# EAGLE design Xenium2019 (EAGLE 9.5.1)
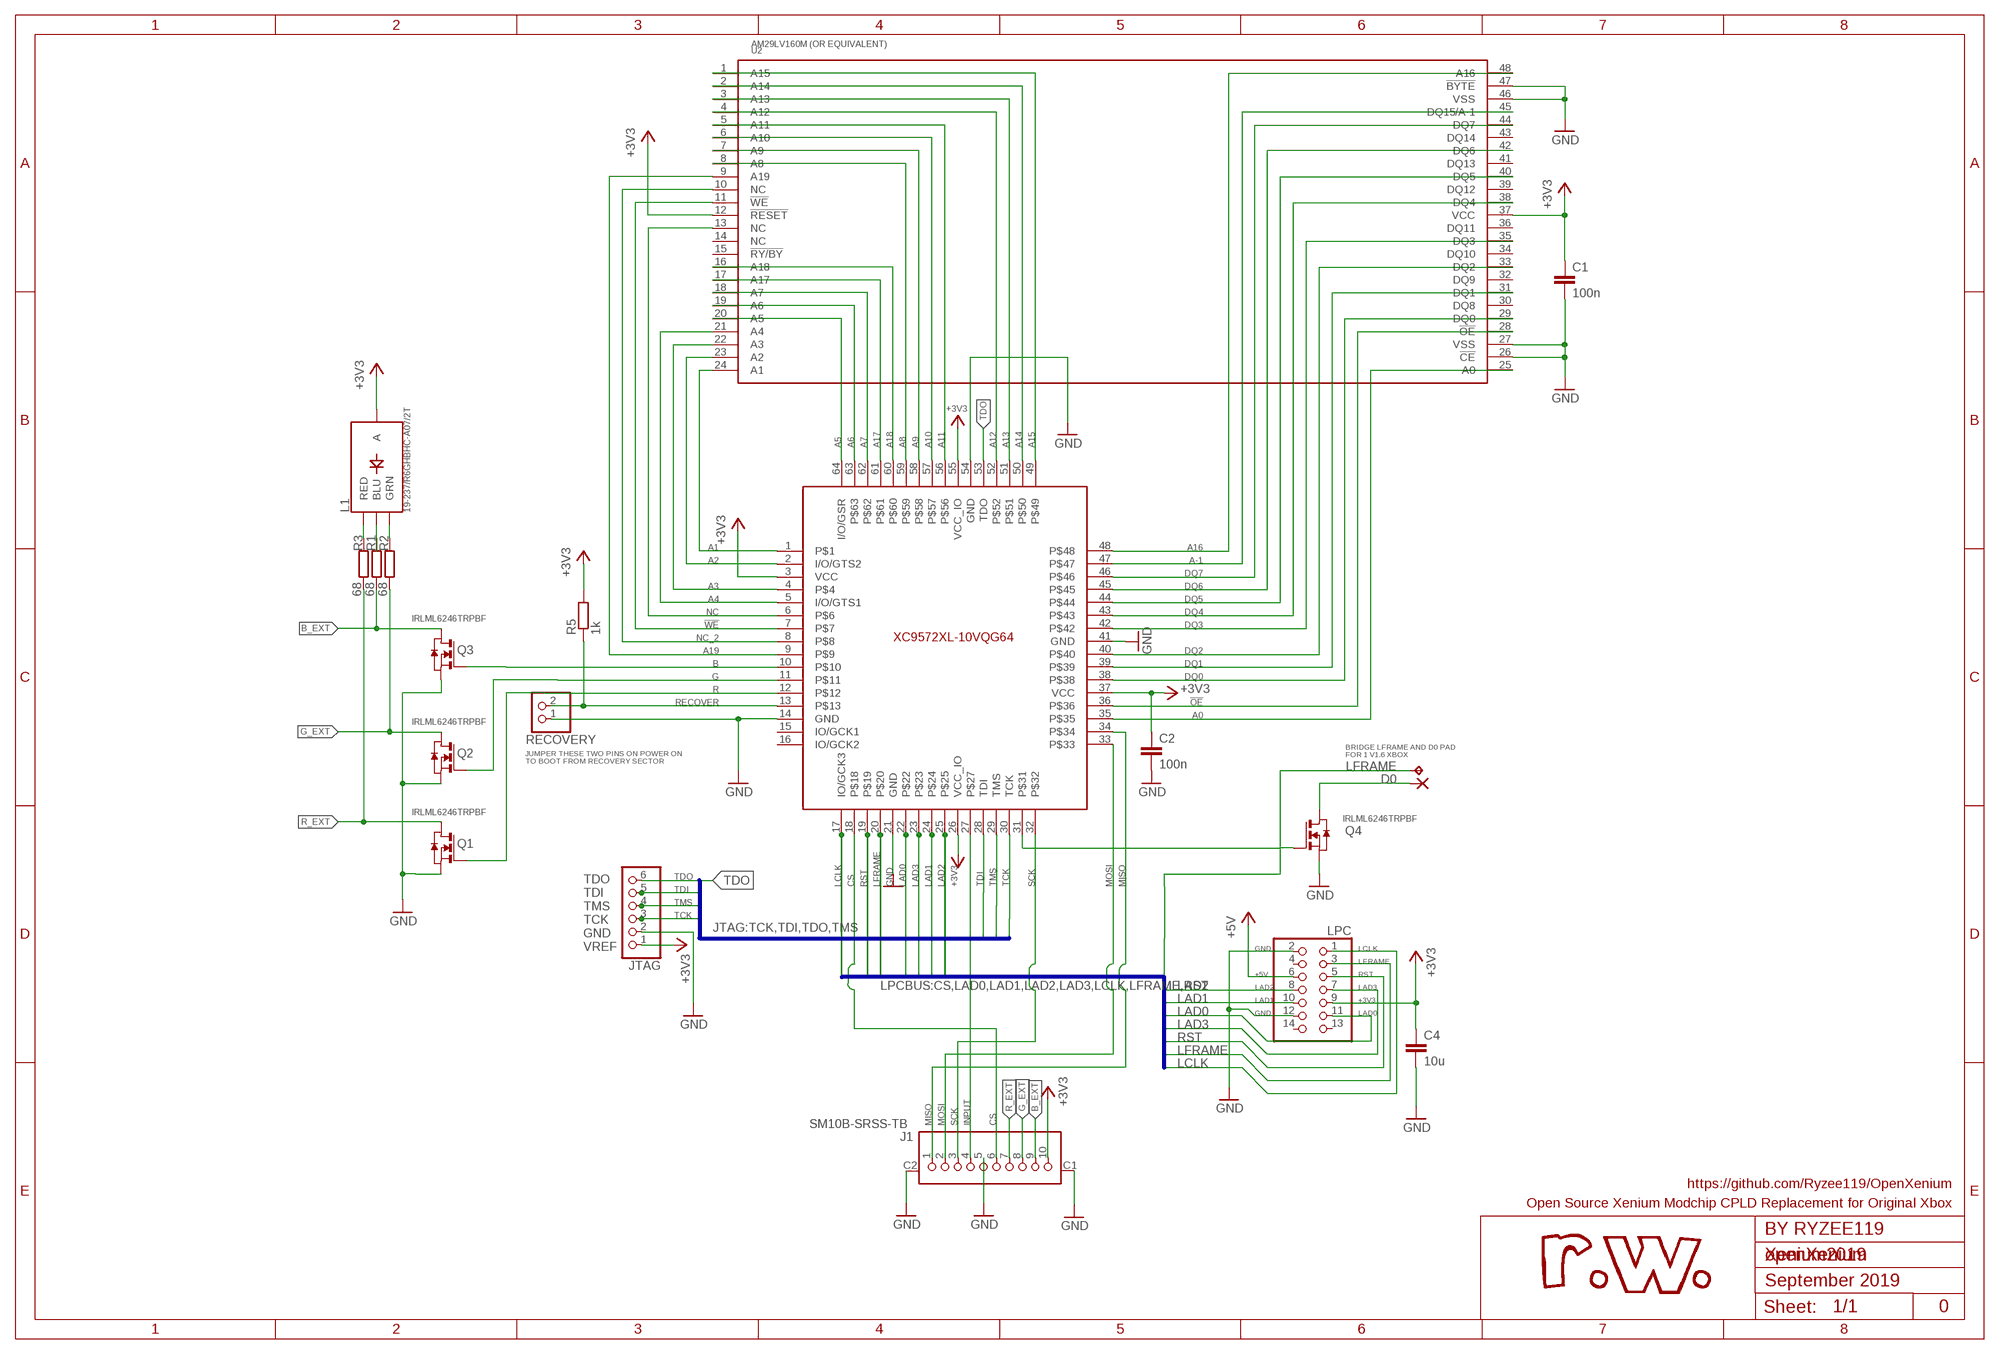
[diagram p0: schematic, sheet 1]

## Parts
C1  100n  C-EUC0603  [C0603]
C2  100n  C-EUC0603  [C0603]
C4  10u  C-EUC0603  [C0603]
D0  SMD2  [SMD1,27-2,54]
J1  SM10B-SRSS-TB  [SM10B-SRSS-TB]
JTAG  PINHD-1X6  [1X06]
L1  19-237/R6GHBHC-A07/2T  [4-SMD-R6GHBHC]
LPC  PINHD-2X7  [2X07]
Q1  310mA/60V/1.6Ω  NMOSSOT23  [SOT-23]
Q2  310mA/60V/1.6Ω  NMOSSOT23  [SOT-23]
Q3  310mA/60V/1.6Ω  NMOSSOT23  [SOT-23]
Q4  310mA/60V/1.6Ω  NMOSSOT23  [SOT-23]
R1  68  R-EU_R0603  [R0603]
R2  68  R-EU_R0603  [R0603]
R3  68  R-EU_R0603  [R0603]
R5  1k  R-EU_R0603  [R0603]
RECOVERY  PINHD-1X2  [1X02]
TP1  TPTP13SQ  [TP13SQ]
U1  XC9572XL-10VQG64  [LQFP64]
U2  AM29LV160M  [TSOP48]

## Nets
!OE: U1.36 U2.28(!OE)
!WE: U1.7 U2.11(!WE)
+3V3: C1.1 C2.1 C4.1 J1.10 JTAG.1 L1.P$2(A) LPC.9 R5.2 U1.3(VCC) U1.26(VCC_IO) U1.37(VCC) U1.55(VCC_IO) U2.12(!RESET) U2.37(VCC)
+5V: LPC.6
A0: U1.35 U2.25(A0)
A1: U1.1 U2.24(A1)
A2: U1.2(I/O/GTS2) U2.23(A2)
A3: U1.4 U2.22(A3)
A4: U1.5(I/O/GTS1) U2.21(A4)
A5: U1.64(I/O/GSR) U2.20(A5)
A6: U1.63 U2.19(A6)
A7: U1.62 U2.18(A7)
A8: U1.59 U2.8(A8)
A9: U1.58 U2.7(A9)
A10: U1.57 U2.6(A10)
A11: U1.56 U2.5(A11)
A12: U1.52 U2.4(A12)
A13: U1.51 U2.3(A13)
A14: U1.50 U2.2(A14)
A15: U1.49 U2.1(A15)
A16: U1.48 U2.48(A16)
A17: U1.61 U2.17(A17)
A18: U1.60 U2.16(A18)
A19: U1.9 U2.9(A19)
A-1: U1.47 U2.45(DQ15/A-1)
B: Q3.3(G) U1.10
B_EXT: J1.9 Q3.1(D) R1.2
BLUE: L1.P$4(BLU) R1.1
CS: J1.6 U1.18
DQ0: U1.38 U2.29(DQ0)
DQ1: U1.39 U2.31(DQ1)
DQ2: U1.40 U2.33(DQ2)
DQ3: U1.42 U2.35(DQ3)
DQ4: U1.43 U2.38(DQ4)
DQ5: U1.44 U2.40(DQ5)
DQ6: U1.45 U2.42(DQ6)
DQ7: U1.46 U2.44(DQ7)
G: Q2.3(G) U1.11
G_EXT: J1.8 Q2.1(D) R2.2
GND: C1.2 C2.2 C4.2 J1.5 J1.C1(MNT2) J1.C2(MNT1) JTAG.2 LPC.2 LPC.12 Q1.2(S) Q2.2(S) Q3.2(S) Q4.2(S) RECOVERY.1 U1.14(GND) U1.21(GND) U1.41(GND) U1.54(GND) U2.26(!CE) U2.27(VSS) U2.46(VSS) U2.47(!BYTE)
GREEN: L1.P$3(GRN) R2.1
INPUT: J1.4 U1.27
LAD0: LPC.11 U1.22
LAD1: LPC.10 U1.24
LAD2: LPC.8 U1.25
LAD3: LPC.7 U1.23
LCLK: LPC.1 U1.17(IO/GCK3)
LFRAME: LPC.3 TP1.TP U1.20
MISO: J1.1 U1.34
MOSI: J1.2 U1.33
N$37: Q4.3(G) U1.31
N$51: D0.1(P) Q4.1(D)
NC: U1.6 U2.13(NC)
NC_2: U1.8 U2.10(NC)
R: Q1.3(G) U1.12
R_EXT: J1.7 Q1.1(D) R3.2
RECOVER: R5.1 RECOVERY.2 U1.13
RED: L1.P$1(RED) R3.1
RST: LPC.5 U1.19
SCK: J1.3 U1.32
TCK: JTAG.3 U1.30(TCK)
TDI: JTAG.5 U1.28(TDI)
TDO: JTAG.6 U1.53(TDO)
TMS: JTAG.4 U1.29(TMS)
Unconnected: LPC.4 LPC.13 LPC.14 U1.15(IO/GCK1) U1.16(IO/GCK2) U2.14(NC) U2.15(!RY/BY) U2.30(DQ8) U2.32(DQ9) U2.34(DQ10) U2.36(DQ11) U2.39(DQ12) U2.41(DQ13) U2.43(DQ14)

## Buses
JTAG:TCK,TDI,TDO,TMS
LPCBUS:CS,LAD0,LAD1,LAD2,LAD3,LCLK,LFRAME,RST

## Notes on the sheet
- (OR EQUIVALENT)
- IRLML6246TRPBF
- IRLML6246TRPBF
- BRIDGE LFRAME AND D0 PAD
  FOR 1 V1.6 XBOX
- JUMPER THESE TWO PINS ON POWER ON
  TO BOOT FROM RECOVERY SECTOR
- IRLML6246TRPBF
- IRLML6246TRPBF
- TDO
  TDI
  TMS
  TCK
  GND
  VREF
- https://github.com/Ryzee119/OpenXenium
- Open Source Xenium Modchip CPLD Replacement for Original Xbox
- BY RYZEE119
- openXenium
- September 2019
- 0

## Library data of the parts
C1 C2 C4 = rcl:C-EU: CAPACITOR, European symbol; SPICEPREFIX: C
D0 = my-library:SMD2: SMD PAD
J1 = my-library:SM10B-SRSS-TB
JTAG = pinhead:PINHD-1X6: PIN HEADER
L1 = my-library:19-237/R6GHBHC-A07/2T
LPC = pinhead:PINHD-2X7: PIN HEADER
Q1-Q4 = zetex:NMOSSOT23: MOS FET; OC_FARNELL: unknown; OC_NEWARK: unknown
R1-R3 R5 = rcl:R-EU_: RESISTOR, European symbol; SPICEPREFIX: R
RECOVERY = pinhead:PINHD-1X2: PIN HEADER
TP1 = testpad:TP: Test pad
U1 = my-library:XC9572XL-10VQG64
U2 = my-library:AM29LV160M

## Board
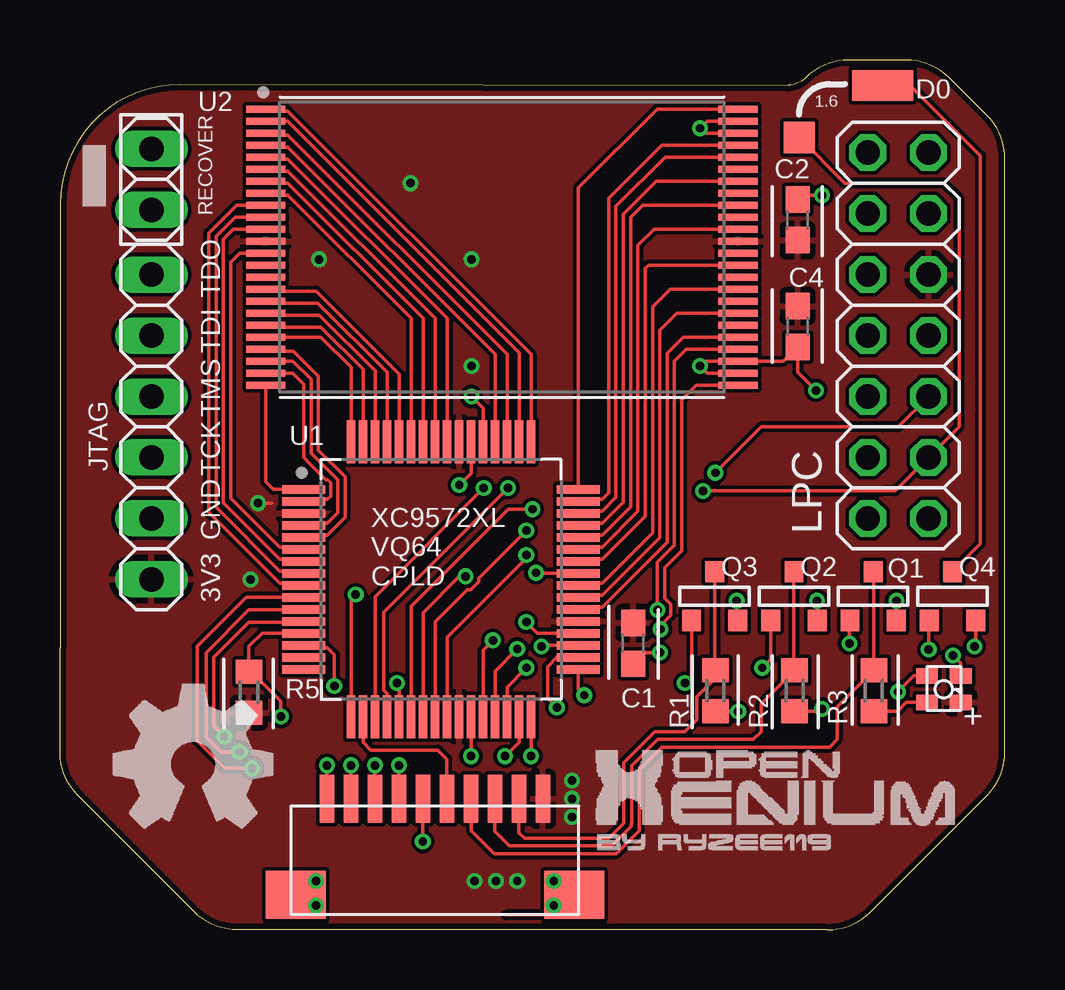
[diagram p1: board, top side]
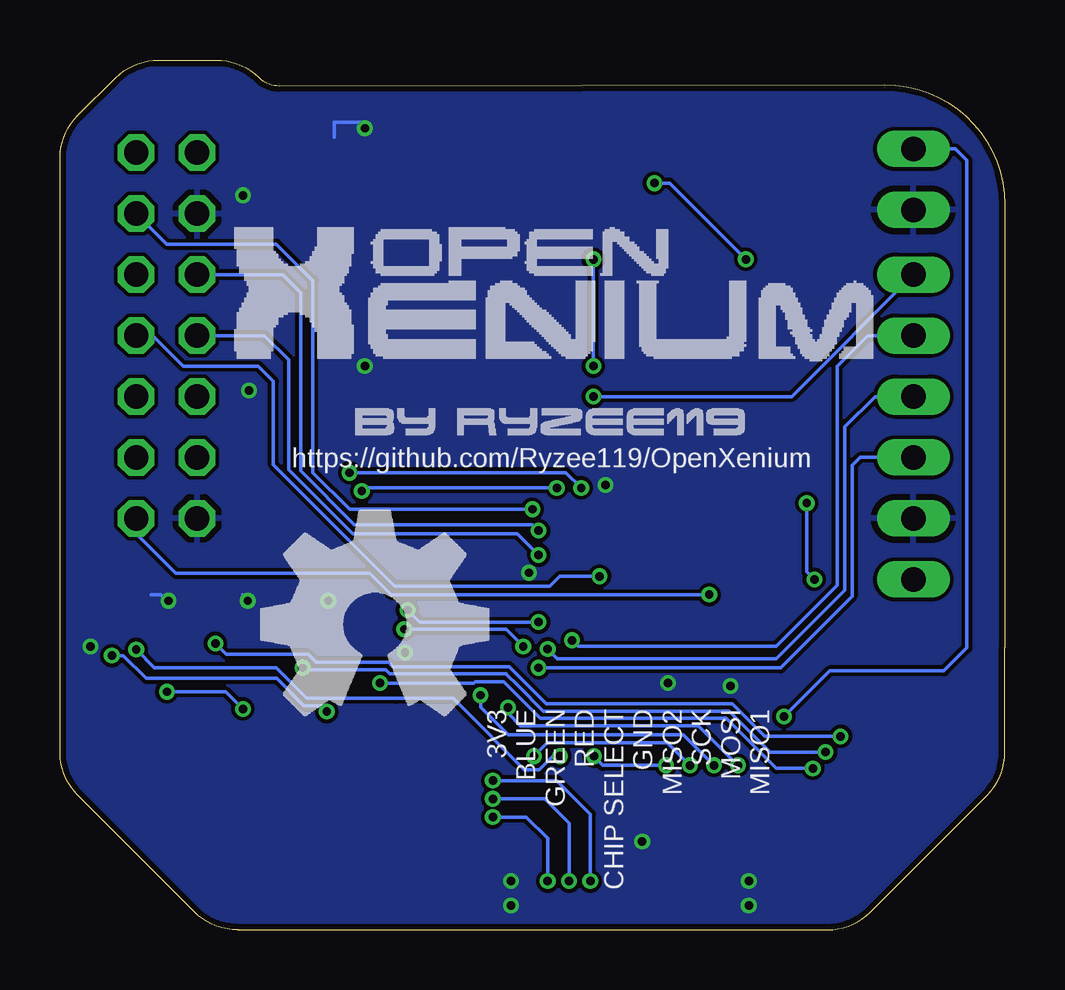
[diagram p2: board, bottom side, seen from below]

Size 39.37 x 36.25 mm. Coordinates in mm from the lower left corner, seen from the top.
Outline: 31.97,0 8.57,0 7.4,0 arc-45 5.61,0.74 0.74,5.61 arc-45 0,7.4 0,11.75 0,14.92 0,30.22 arc-90 5.01,35.22 30.24,35.18 arc44 31.09,35.52 arc-44 32.86,36.25 35.26,36.25 arc-45 37.05,35.51 38.62,33.94 arc-45 39.37,32.14 39.37,7.4 arc-45 38.63,5.61 33.76,0.74 arc-45 31.97,0
Copper layers (1*16): Top 0.035mm / dielectric 1.5mm / Bottom 0.035mm
Design rules "Elecrow_2-layer_eagle_rule": minimum track width 6mil, minimum drill 12mil, track to track 6mil, track to pad 6mil, pad to pad 6mil, via to via 6mil, smd to smd 0mil, copper to edge 10mil, drill to drill 10mil, minimum pad ring 10mil, minimum via ring 6mil, stop-mask expansion 2mil, vias tented up to drill 100mil, thermal gap 10mil

### Footprints (pad centres in the part's own frame; a part is rotated, then mirrored left to right if it is on the bottom)
C0603 = smd 1.1 x 1: 1 -0.85,0; 2 0.85,0
SMD1,27-2,54 = smd 1.27 x 2.54: 1 0,0
SM10B-SRSS-TB = smd 0.6 x 2: 1 -4.5,0; 2 -3.5,0; 3 -2.5,0; 4 -1.5,0; 5 -0.5,0; 6 0.5,0; 7 1.5,0; 8 2.5,0; 9 3.5,0; 10 4.5,0 | smd 2.5 x 2: C1 -5.8,-4; C2 5.8,-4
1X06 = drill 1.016 long: 1 -6.35,0; 2 -3.81,0; 3 -1.27,0; 4 1.27,0; 5 3.81,0; 6 6.35,0
4-SMD-R6GHBHC = smd 0.9 x 0.65: P$1 -0.7,-0.55; P$2 0.7,-0.55; P$3 -0.7,0.55; P$4 0.7,0.55
2X07 = drill 1.016 octagon: 1 -7.62,-1.27; 2 -7.62,1.27; 3 -5.08,-1.27; 4 -5.08,1.27; 5 -2.54,-1.27; 6 -2.54,1.27; 7 0,-1.27; 8 0,1.27; 9 2.54,-1.27; 10 2.54,1.27; 11 5.08,-1.27; 12 5.08,1.27; 13 7.62,-1.27; 14 7.62,1.27
SOT-23 = smd 0.787 x 0.889: 1 0.025,-1.016; 2 -0.94,1.016; 3 0.991,1.016
R0603 = smd 1 x 1.1: 1 -0.85,0; 2 0.85,0
1X02 = drill 1.016 long: 1 -1.27,0; 2 1.27,0
TP13SQ = smd 1.3 x 1.3: TP 0,0
LQFP64 = smd 1.788 x 0.363: 1 -5.727,3.75; 2 -5.727,3.25; 3 -5.727,2.75; 4 -5.727,2.25; 5 -5.727,1.75; 6 -5.727,1.25; 7 -5.727,0.75; 8 -5.727,0.25; 9 -5.727,-0.25; 10 -5.727,-0.75; 11 -5.727,-1.25; 12 -5.727,-1.75; 13 -5.727,-2.25; 14 -5.727,-2.75; 15 -5.727,-3.25; 16 -5.727,-3.75; 33 5.727,-3.75; 34 5.727,-3.25; 35 5.727,-2.75; 36 5.727,-2.25; 37 5.727,-1.75; 38 5.727,-1.25; 39 5.727,-0.75; 40 5.727,-0.25; 41 5.727,0.25; 42 5.727,0.75; 43 5.727,1.25; 44 5.727,1.75; 45 5.727,2.25; 46 5.727,2.75; 47 5.727,3.25; 48 5.727,3.75 | smd 0.363 x 1.788: 17 -3.75,-5.727; 18 -3.25,-5.727; 19 -2.75,-5.727; 20 -2.25,-5.727; 21 -1.75,-5.727; 22 -1.25,-5.727; 23 -0.75,-5.727; 24 -0.25,-5.727; 25 0.25,-5.727; 26 0.75,-5.727; 27 1.25,-5.727; 28 1.75,-5.727; 29 2.25,-5.727; 30 2.75,-5.727; 31 3.25,-5.727; 32 3.75,-5.727; 49 3.75,5.727; 50 3.25,5.727; 51 2.75,5.727; 52 2.25,5.727; 53 1.75,5.727; 54 1.25,5.727; 55 0.75,5.727; 56 0.25,5.727; 57 -0.25,5.727; 58 -0.75,5.727; 59 -1.25,5.727; 60 -1.75,5.727; 61 -2.25,5.727; 62 -2.75,5.727; 63 -3.25,5.727; 64 -3.75,5.727
TSOP48 = smd 1.636 x 0.3: 1 -9.839,5.75; 2 -9.839,5.25; 3 -9.839,4.75; 4 -9.839,4.25; 5 -9.839,3.75; 6 -9.839,3.25; 7 -9.839,2.75; 8 -9.839,2.25; 9 -9.839,1.75; 10 -9.839,1.25; 11 -9.839,0.75; 12 -9.839,0.25; 13 -9.839,-0.25; 14 -9.839,-0.75; 15 -9.839,-1.25; 16 -9.839,-1.75; 17 -9.839,-2.25; 18 -9.839,-2.75; 19 -9.839,-3.25; 20 -9.839,-3.75; 21 -9.839,-4.25; 22 -9.839,-4.75; 23 -9.839,-5.25; 24 -9.839,-5.75; 25 9.839,-5.75; 26 9.839,-5.25; 27 9.839,-4.75; 28 9.839,-4.25; 29 9.839,-3.75; 30 9.839,-3.25; 31 9.839,-2.75; 32 9.839,-2.25; 33 9.839,-1.75; 34 9.839,-1.25; 35 9.839,-0.75; 36 9.839,-0.25; 37 9.839,0.25; 38 9.839,0.75; 39 9.839,1.25; 40 9.839,1.75; 41 9.839,2.25; 42 9.839,2.75; 43 9.839,3.25; 44 9.839,3.75; 45 9.839,4.25; 46 9.839,4.75; 47 9.839,5.25; 48 9.839,5.75

### Placement (x,y rotation side)
C1  23.88,11.94 270 top
C2  30.73,29.59 90 top
C4  30.73,25.15 270 top
D0  34.29,35.18 90 top
J1  15.62,5.46 0 top
JTAG  3.81,20.95 90 top
L1  36.83,10.03 0 top
LPC  34.93,24.77 90 top
Q1  33.91,13.91 180 top
Q2  30.61,13.91 180 top
Q3  27.3,13.91 180 top
Q4  37.21,13.91 180 top
R1  27.3,9.97 90 top
R2  30.61,9.97 90 top
R3  33.91,9.97 90 top
R5  7.87,9.91 270 top
RECOVERY  3.81,31.27 90 top
TP1  30.8,33.02 0 top
U1  15.88,14.61 0 top
U2  18.41,28.45 0 top

### Tracks (layer width: path | path; a pad name or v marks a point on that pad's centre or on a via)
!OE  (via drill 0.35)
  Top 0.152: U2.28 26.1,24.2 25.6,23.7 25.6,16.03 24.89,15.31 v24.89,13.34 | U1.36 20.31,12.36 20.3,12.37 19.89,12.37 v19.43,12.83
  Bottom 0.152: v24.89,13.34 24.38,12.83 v19.43,12.83
!WE
  Top 0.152: U1.7 10.06,15.45 9.16,15.45 6.81,17.8 6.81,28.78 7.23,29.2 U2.11
+3V3  (via drill 0.35)
  Top 0.152: 8.82,17.78 v8.26,17.78
  Bottom 0.152: v10.79,27.94 13.97,31.11 v14.61,31.11 | v17.14,23.5 v17.14,27.94 | v19.05,2.03 19.05,3.81 19.94,4.7 v21.34,4.7 | v18.16,2.03 18.16,4.45 19.18,5.46 v21.34,5.46 | v17.27,2.03 17.27,4.83 18.67,6.22 v21.34,6.22 | v8.26,17.78 8.26,14.92 v7.94,14.61
  pour Top: -1.75,-3.23 -1.75,42.75 40.69,42.75 40.69,-3.23
A0  (via drill 0.35)
  Top 0.152: U2.25 26.51,22.7 25.91,22.1 25.91,15.8 25.2,15.09 25.2,13.82 25.45,13.56 25.45,13.11 25.02,12.68 v25.02,12.53 | v20.07,11.81 20.11,11.86 U1.35
  Bottom 0.152: v25.02,12.53 24.52,12.53 24.51,12.52 20.78,12.52 v20.07,11.81
A1
  Top 0.152: U1.1 8.89,18.36 8.58,18.67 U2.24
A2
  Top 0.152: U1.2 10.24,17.95 11.14,17.95 11.27,18.08 11.27,18.63 11.14,18.77 11.08,18.77 10.41,19.43 10.16,19.68 10.16,22.73 9.7,23.2 U2.23
A3
  Top 0.152: U1.4 10.24,16.95 11.14,16.95 11.58,17.38 11.58,18.76 10.46,19.87 10.46,22.94 9.7,23.7 U2.22
A4
  Top 0.152: U2.21 8.58,24.12 9.71,24.12 10.77,23.06 10.77,20 11.88,18.88 11.88,17.19 11.14,16.45 10.24,16.45 U1.5
A5
  Top 0.152: U1.64 12.12,23.43 10.86,24.7 U2.20
A6
  Top 0.152: U2.19 8.66,25.12 10.87,25.12 12.62,23.37 U1.63
A7
  Top 0.152: U2.18 8.66,25.62 10.8,25.62 13.12,23.3 U1.62
A8
  Top 0.152: U2.8 8.66,30.62 9.49,30.62 14.62,25.48 U1.59
A9
  Top 0.152: U2.7 8.66,31.12 9.49,31.12 15.12,25.48 U1.58
A10
  Top 0.152: U2.6 8.66,31.62 9.49,31.62 15.62,25.48 U1.57
A11
  Top 0.152: U2.5 8.66,32.12 9.49,32.12 16.12,25.48 U1.56
A12
  Top 0.152: U2.4 8.66,32.62 9.49,32.62 18.12,23.98 U1.52
A13
  Top 0.152: U2.3 8.66,33.12 9.49,33.12 18.62,23.98 U1.51
A14
  Top 0.152: U1.50 19.12,24.05 9.48,33.7 U2.2
A15
  Top 0.152: U2.1 8.66,34.12 9.49,34.12 19.62,23.99 U1.49
A16
  Top 0.152: U2.48 24.88,34.2 21.6,30.92 U1.48
A17
  Top 0.152: U2.17 8.66,26.12 10.74,26.12 13.62,23.23 U1.61
A18
  Top 0.152: U2.16 8.66,26.62 10.67,26.62 14.12,23.16 U1.60
A19
  Top 0.152: U1.9 10.06,14.45 9.16,14.45 6.2,17.41 6.2,29.03 7.37,30.2 U2.9
A-1
  Top 0.152: U1.47 21.69,17.95 22.59,17.95 22.86,18.21 22.86,30.48 25.08,32.7 U2.45
B  (via drill 0.35)
  Top 0.152: U1.10 7.76,13.86 5.71,11.81 5.71,7.87 6.86,6.73 v8,6.73 | v26.04,10.29 26.31,10.57 Q3.3
  Bottom 0.152: v8,6.73 9.53,6.73 11.61,8.81 19.36,8.81 20.88,10.34 22.07,10.34 22.12,10.29 25.91,10.29 v26.04,10.29
B_EXT
  Top 0.152: 27.28,11.05 R1.2 | 27.28,11.05 R1.2 | Q3.1 27.28,11.05 | J1.9 19.12,4.06 19.37,3.81 22.86,3.81 23.5,4.45 23.5,6.35 23.5,6.96 24.79,8.26 26.04,8.26 26.53,8.75 26.53,9.71 27.3,10.49 R1.2
BLUE  (via drill 0.35)
  Top 0.152: v37.21,11.43 37.53,11.11 L1.P$4 | v28.26,9.1 28.23,9.12 R1.1
  Bottom 0.152: v37.21,11.43 36.73,11.43 35.78,10.48 30.34,10.48 29.21,9.35 28.51,9.35 v28.26,9.1
CS
  Top 0.152: J1.6 16.12,7.12 15.75,7.49 12.95,7.49 12.62,7.82 U1.18
DQ0
  Top 0.152: U2.29 25.97,24.7 25.3,24.03 25.3,16.15 22.59,13.45 21.69,13.45 U1.38
DQ1
  Top 0.152: U2.31 25.7,25.7 24.99,24.99 24.99,16.35 22.59,13.95 21.69,13.95 U1.39
DQ2
  Top 0.152: U2.33 25.43,26.7 24.69,25.96 24.69,16.54 22.59,14.45 21.69,14.45 U1.40
DQ3
  Top 0.152: U2.35 24.52,27.7 24.38,27.56 24.38,17.24 22.59,15.45 21.69,15.45 U1.42
DQ4
  Top 0.152: U2.38 24.75,29.2 24.08,28.52 24.08,17.43 22.59,15.95 21.69,15.95 U1.43
DQ5
  Top 0.152: U2.40 24.28,30.2 23.77,29.69 23.77,17.63 22.59,16.45 21.69,16.45 U1.44
DQ6
  Top 0.152: U2.42 24.85,31.2 23.47,29.82 23.47,17.82 22.59,16.95 21.69,16.95 U1.45
DQ7
  Top 0.152: U2.44 25.21,32.2 23.16,30.15 23.16,18.02 22.59,17.45 21.69,17.45 U1.46
G  (via drill 0.35)
  Top 0.152: U1.11 10.13,13.34 7.87,13.34 6.1,11.56 6.1,8.03 6.71,7.41 v7.47,7.41 | v29.26,10.92 29.62,11.28 Q2.3
  Bottom 0.152: v7.47,7.41 9.77,7.41 11.48,9.12 19.23,9.12 20.29,10.19 20.75,10.64 | 20.75,10.64 20.78,10.67 | v29.26,10.92 29.18,10.84 25.8,10.84 25.63,10.67 20.78,10.67 | 20.78,10.67 20.75,10.64
G_EXT
  Top 0.152: Q2.1 30.58,10.85 R2.2 29.21,9.42 29.21,8.26 28.89,7.94 24.9,7.94 23.81,6.85 23.81,4.45 23.8,4.43 23.8,4.32 22.99,3.5 18.72,3.5 18.12,4.1 J1.8
GND  (via drill 0.35)
  Top 0.152: U1.54 17.12,19.03 v16.64,18.54 | U1.14 10.24,11.77 11.14,11.77 11.43,11.47 v11.43,10.16 | U2.26 26.97,23.2 v26.67,23.5 26.87,23.7 U2.27 30.14,23.7 C4.2 30.73,23.24 v31.5,22.48 | U2.46 26.87,33.2 v26.67,33.4 26.97,33.7 U2.47 | C1.2 24.34,11.56 v24.99,11.56 | C2.2 30.9,30.61 v31.75,30.61 | 34.86,12.88 34.79,12.8 | U1.21 14.12,10.2 v14.04,10.29 | U1.41 19.86,14.86 v19.83,14.88 | Q4.2 38.15,11.86 v38.1,11.81 | J1.5 15.12,3.69 v15.11,3.68 | v34.85,13.72 34.85,13.64 Q1.2 34.86,12.88 | Q3.2 28.19,12.94 v28.19,13.72 | Q2.2 31.55,13.66 v31.55,13.72 | J1.C1 10.22,1.46 v10.67,1.02 | 18.59,0.63 22.22,0.63 22.22,0.66 J1.C2 20.98,1.02 v20.57,1.02 | 34.86,12.88
  Bottom 0.152: v26.67,33.4 26.67,33.66 27.94,33.66 27.94,33.02 | v34.85,13.72 35.18,13.97 35.56,13.97 | v31.55,13.72 31.75,13.97
  other vias: 20.57,2.03 10.67,2.03
  pour Bottom: -1.68,-3.17 -1.68,42.55 40.59,42.55 40.59,-3.17
GREEN  (via drill 0.35)
  Top 0.152: R2.1 31.66,9.12 v31.75,9.21 | v34.92,9.92 35.58,10.58 L1.P$3
  Bottom 0.152: v31.75,9.21 32.46,9.92 v34.92,9.92
INPUT  (via drill 0.35)
  Top 0.152: J1.4 14.12,6.75 v14.12,6.86 | v17.12,7.24 17.12,7.26 U1.27
  Bottom 0.152: v14.12,6.86 16.76,6.86 v17.12,7.24
LAD0  (via drill 0.35)
  Top 0.152: U1.22 14.62,13.48 15.88,14.73 18.67,17.53 v19.68,17.53
  Bottom 0.152: v19.68,17.53 27.3,17.53 28.83,19.05 28.83,27.05 30.35,28.57 34.93,28.57 LPC.11
LAD1  (via drill 0.35)
  Top 0.152: 15.62,12.83 15.62,12.7 | 15.62,12.7 U1.24 | 15.62,12.83 15.62,12.7 | v19.43,16.64 17.45,14.65 17.45,14.5 17.12,14.18 16.97,14.18 15.62,12.83
  Bottom 0.152: v19.43,16.64 19.68,16.89 27.1,16.89 29.34,19.13 29.34,26.54 29.97,27.18 30.1,27.3 LPC.10
LAD2  (via drill 0.35)
  Top 0.152: U1.25 16.12,12.19 19.43,15.49 v19.43,15.62
  Bottom 0.152: v19.43,15.62 20.32,16.51 27.17,16.51 29.84,19.18 29.84,23.75 30.86,24.77 LPC.8
LAD3  (via drill 0.35)
  Top 0.152: U1.23 15.12,13.22 16.64,14.73 v16.89,14.73
  Bottom 0.152: v16.89,14.73 18.55,14.73 18.96,14.33 25.42,14.33 30.48,19.39 30.48,22.86 31.11,23.5 34.23,23.5 35.5,24.77 LPC.7
LCLK  (via drill 0.35)
  Top 0.152: U1.17 12.12,13.78 v12.32,13.97
  Bottom 0.152: v12.32,13.97 25.57,13.97 26.45,14.86 34.54,14.86 36.2,16.51 LPC.1
LFRAME  (via drill 0.35)
  Top 0.152: U1.20 13.62,9.85 13.48,9.99 13.48,13.23 v18.67,18.41 | v26.8,18.29 34.29,18.29 34.8,18.29 LPC.3 37.47,20.95 37.47,30.48 36.83,31.11 32.7,31.11 TP1.TP
  Bottom 0.152: v18.67,18.41 26.67,18.41 v26.8,18.29
MISO  (via drill 0.35)
  Top 0.152: U1.34 20.7,11.36 20.32,10.97 20.32,9.65 v20.7,9.27 | J1.1 11.12,6.8 v11.12,6.86
  Bottom 0.152: v11.12,6.86 12.77,8.51 20.19,8.51 20.7,9.02 v20.7,9.27
MOSI  (via drill 0.35)
  Top 0.152: J1.2 v12.12,6.86 | v21.84,9.78 21.6,10.02 U1.33
  Bottom 0.152: v12.12,6.86 13.39,8.13 20.7,8.13 21.84,9.27 v21.84,9.78
N$37  (via drill 0.35)
  Top 0.152: Q4.3 36.22,12.83 36.2,12.8 v36.2,11.68 | U1.31 19.12,7.82 v18.54,7.24
  Bottom 0.152: v18.54,7.24 18.84,7.24 19.39,6.68 19.89,6.68 20.02,6.68 22.73,9.4 22.99,9.65 25.4,9.65 29.08,9.65 30.35,10.92 35.43,10.92 v36.2,11.68
N$51
  Top 0.152: D0.1 35.43,35.18 38.35,32.26 38.35,16.09 Q4.1
NC
  Top 0.152: U1.6 10.06,15.95 9.16,15.95 7.11,17.99 7.11,27.81 7.5,28.2 U2.13
NC_2
  Top 0.152: U1.8 10.06,14.95 9.16,14.95 6.5,17.6 6.5,28.9 7.3,29.7 U2.10
R  (via drill 0.35)
  Top 0.152: U1.12 10.12,12.83 7.87,12.83 6.4,11.35 6.4,8.51 v6.84,8.06 | v32.89,11.94 32.89,12.87 Q1.3
  Bottom 0.152: v6.84,8.06 9.99,8.06 11.36,9.42 19.1,9.42 20.65,10.97 25.5,10.97 25.68,11.15 28.7,11.15 29.03,11.48 32.43,11.48 v32.89,11.94
R_EXT
  Top 0.152: Q1.1 33.91,14.9 R3.2 32.38,9.3 32.38,7.94 32.07,7.62 25.08,7.62 24.13,6.67 24.13,4.13 23.18,3.17 18.1,3.17 17.14,4.13 17.14,5.44 J1.7
RECOVER  (via drill 0.35)
  Top 0.152: v9.21,8.89 9.21,9.53 7.98,10.76 R5.1 7.87,11.81 8.42,12.36 U1.13
  Bottom 0.152: RECOVERY.2 2.06,32.54 1.59,32.07 1.59,11.75 2.54,10.79 7.3,10.79 v9.21,8.89
RED
  Top 0.152: R3.1 34.9,9.12 35.26,9.48 L1.P$1
RST  (via drill 0.35)
  Top 0.152: U1.19 13.12,13.89 v17.65,18.41 | v27.3,19.05 29.21,20.95 34.29,20.95 34.93,20.95 LPC.5
  Bottom 0.152: v17.65,18.41 18.29,19.05 v27.3,19.05
SCK  (via drill 0.35)
  Top 0.152: J1.3 13.12,6.82 v13.12,6.86 | U1.32 v19.62,7.24
  Bottom 0.152: v13.12,6.86 14.06,7.79 17.36,7.79 19.07,7.79 v19.62,7.24
TCK  (via drill 0.35)
  Top 0.152: U1.30 18.62,10.12 v19.43,10.92
  Bottom 0.152: JTAG.3 6.03,19.68 6.36,19.36 6.36,13.91 9.35,10.92 v19.43,10.92
TDI  (via drill 0.35)
  Top 0.152: U1.28 17.62,11.66 v18.03,12.06
  Bottom 0.152: v18.03,12.06 17.78,11.81 9.53,11.81 6.98,14.35 6.98,23.5 5.71,24.77 JTAG.5
TDO  (via drill 0.35)
  Top 0.152: v17.14,22.23 17.62,21.75 U1.53
  Bottom 0.152: JTAG.6 8.89,22.23 v17.14,22.23
TMS  (via drill 0.35)
  Top 0.152: U1.29 18.12,10.78 v19.05,11.71
  Bottom 0.152: v19.05,11.71 18.64,11.3 9.53,11.3 6.67,14.16 6.67,20.95 5.4,22.23 JTAG.4

### Text on the board
tPlace: 1.6 | RECOVER | TDO | TDI | TMS | TCK | GND | 3V3 | XC9572XL / VQ64 / CPLD | +
bPlace: https://github.com/Ryzee119/OpenXenium | 3V3 / BLUE / GREEN / RED / CHIP SELECT / GND / MISO2 / SCK / MOSI / MISO1